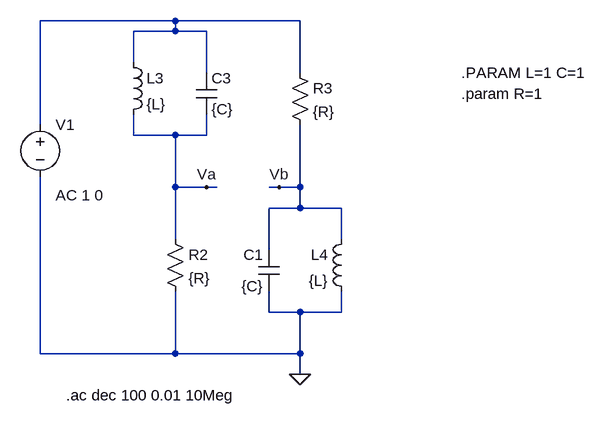
[diagram p0: schematic Allpasscircuit.asc]
Allpasscircuit.asc, the LTspice schematic file:
Version 4
SHEET 1 1496 680
WIRE 352 -16 144 -16
WIRE 544 -16 352 -16
WIRE 352 0 352 -16
WIRE 352 0 288 0
WIRE 400 0 352 0
WIRE 288 48 288 0
WIRE 400 64 400 0
WIRE 544 64 544 -16
WIRE 144 144 144 -16
WIRE 288 160 288 128
WIRE 352 160 288 160
WIRE 400 160 400 128
WIRE 400 160 352 160
WIRE 352 240 352 160
WIRE 400 240 352 240
WIRE 416 240 400 240
WIRE 512 240 496 240
WIRE 544 240 544 144
WIRE 544 240 512 240
WIRE 544 272 544 240
WIRE 544 272 496 272
WIRE 608 272 544 272
WIRE 352 320 352 240
WIRE 608 320 608 272
WIRE 496 336 496 272
WIRE 496 432 496 400
WIRE 544 432 496 432
WIRE 608 432 608 400
WIRE 608 432 544 432
WIRE 144 496 144 224
WIRE 352 496 352 400
WIRE 352 496 144 496
WIRE 544 496 544 432
WIRE 544 496 352 496
WIRE 544 528 544 496
FLAG 544 528 0
FLAG 400 240 Va
FLAG 512 240 Vb
SYMBOL voltage 144 128 R0
WINDOW 123 24 124 Left 2
WINDOW 39 0 0 Left 0
SYMATTR Value2 AC 1 0
SYMATTR InstName V1
SYMATTR Value ""
SYMBOL cap 512 336 M0
SYMATTR InstName C1
SYMATTR Value {C}
SYMBOL cap 384 64 R0
SYMATTR InstName C3
SYMATTR Value {C}
SYMBOL ind 272 32 R0
SYMATTR InstName L3
SYMATTR Value {L}
SYMBOL ind 624 304 M0
SYMATTR InstName L4
SYMATTR Value {L}
SYMBOL res 336 304 R0
SYMATTR InstName R2
SYMATTR Value {R}
SYMBOL res 528 48 R0
SYMATTR InstName R3
SYMATTR Value {R}
TEXT 184 560 Left 2 !.ac dec 100 0.01 10Meg
TEXT 792 64 Left 2 !.PARAM L=1 C=1
TEXT 792 96 Left 2 !.param R=1

The netlist it stands for:
* Allpasscircuit.asc
V1 N001 0 AC 1 0
C1 Vb 0 {C}
C3 N001 Va {C}
L3 N001 Va {L}
L4 Vb 0 {L}
R2 Va 0 {R}
R3 N001 Vb {R}
.ac dec 100 0.01 10Meg
.PARAM L=1 C=1
.param R=1
.backanno
.end

* Results of the author's LTspice run, read from the files saved beside the schematic
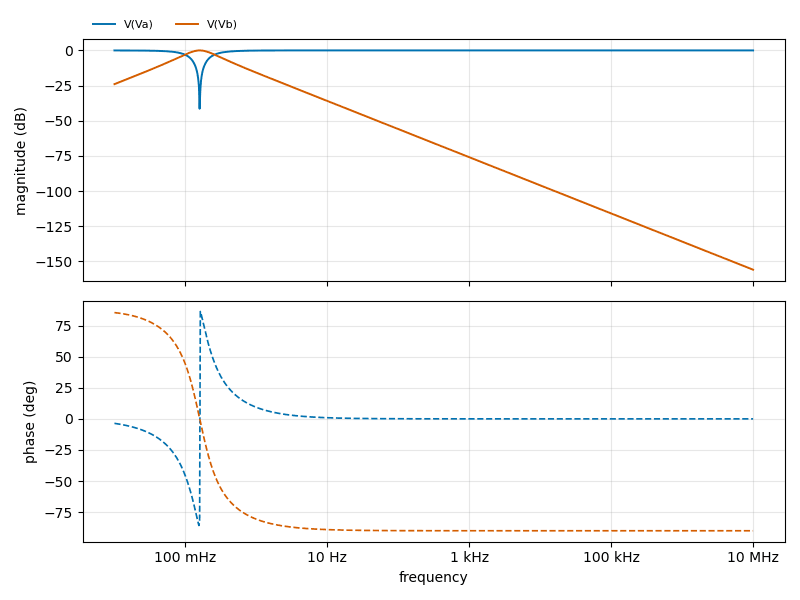
[diagram p1: AC Analysis of Allpasscircuit.asc, plotted from the saved traces]
* AC Analysis, 1 run:
*   V(Va): -0.03 dB at 10 mHz, -0.00 dB at 10 MHz, peak -0.00 dB at 8.71 MHz, 3 dB below the peak at 257.6 mHz
*   V(Vb): -24.03 dB at 10 mHz, -155.96 dB at 10 MHz, peak -0.01 dB at 158.5 mHz, 3 dB below the peak at 98.39 mHz and 257.7 mHz